# EAGLE design tapecleaner (EAGLE 6.3)
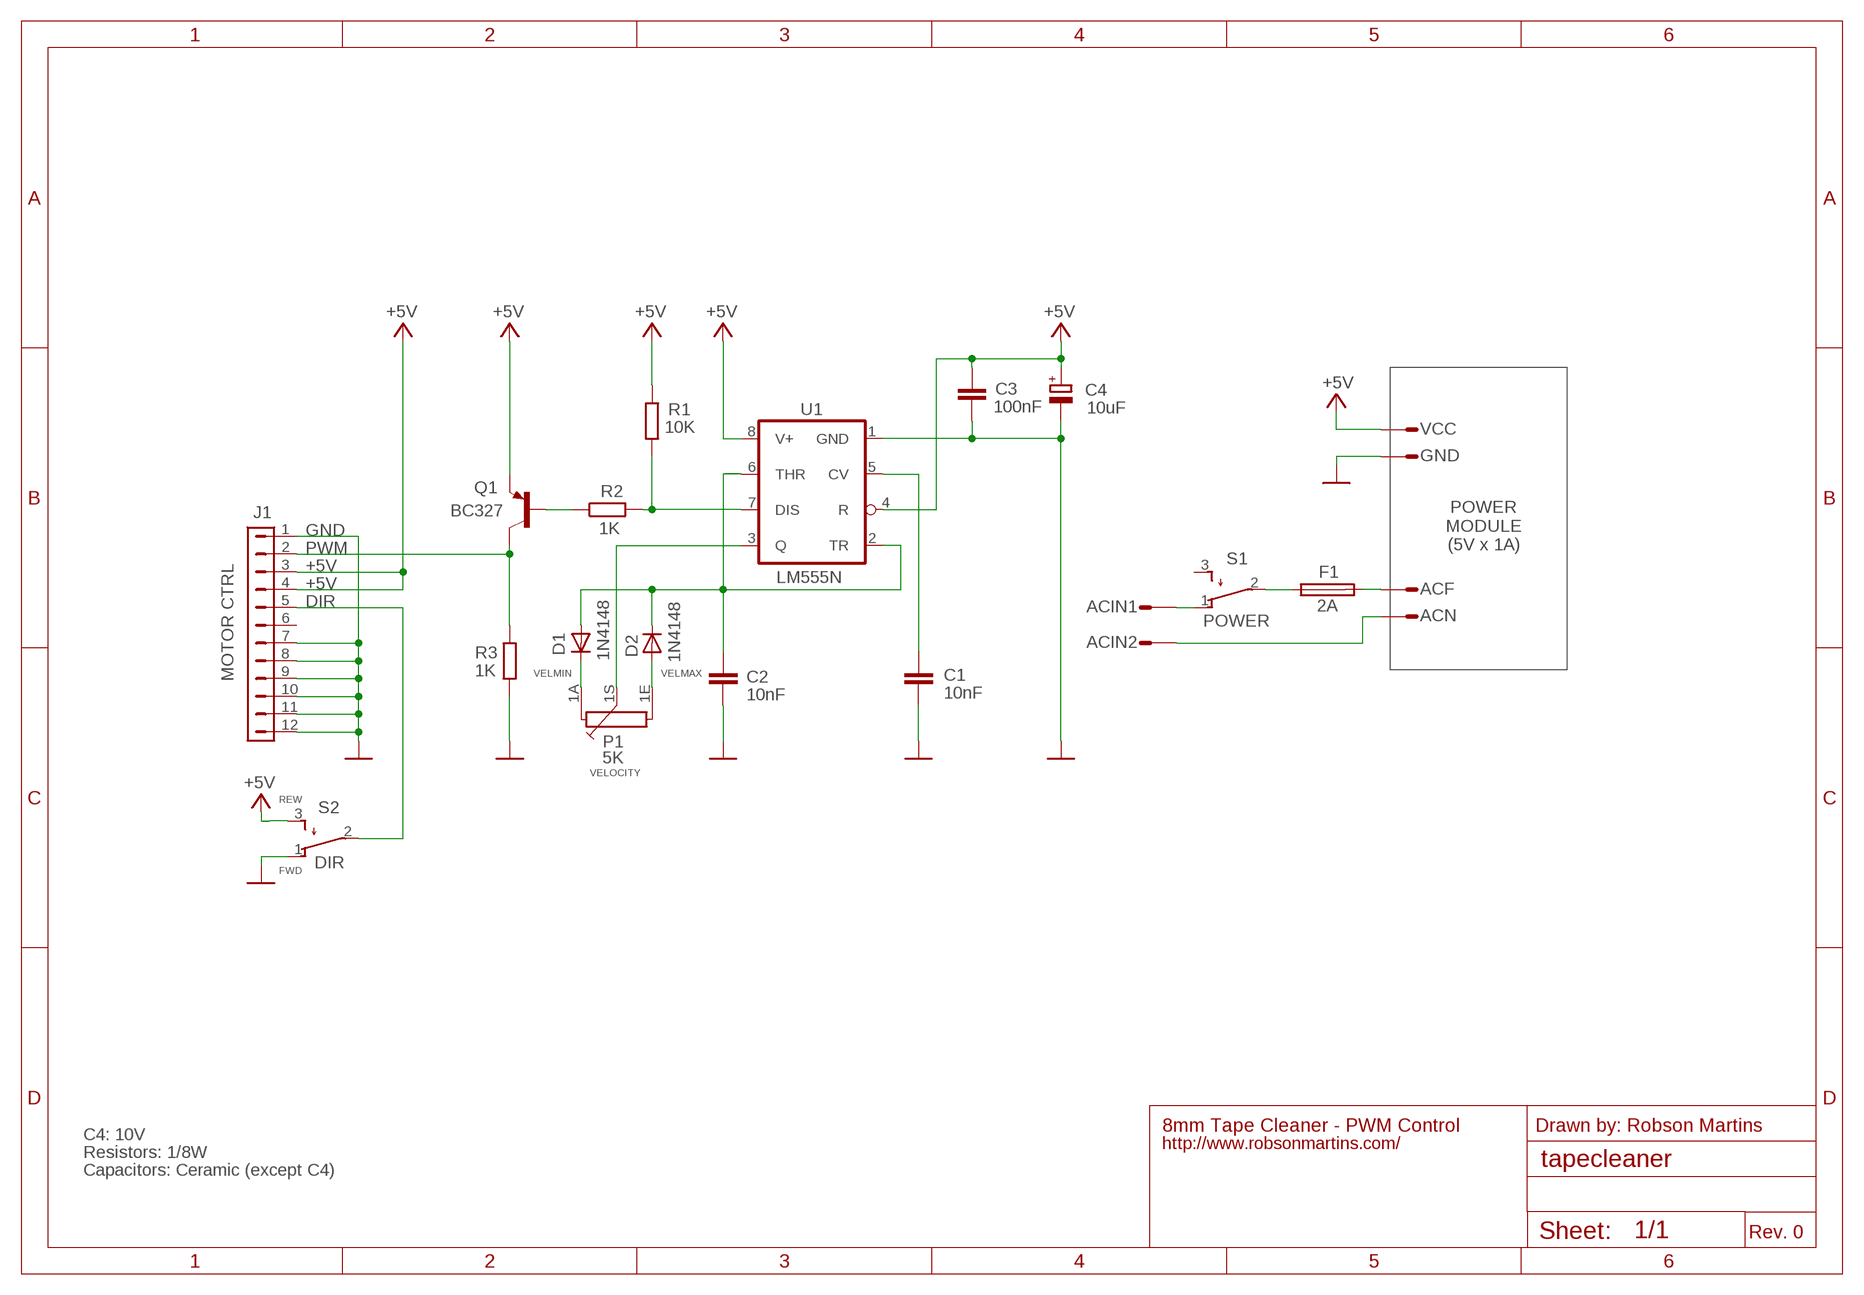
[diagram p0: schematic, sheet 1]

## Parts
ACF  ST2,8  [ST2,8]
ACIN1  ST2,8  [ST2,8]
ACIN2  ST2,8  [ST2,8]
ACN  ST2,8  [ST2,8]
C1  10nF  C-EU050-025X075  [C050-025X075]
C2  10nF  C-EU050-025X075  [C050-025X075]
C3  100nF  C-EU050-025X075  [C050-025X075]
C4  10uF  CPOL-EUE2,5-6E  [E2,5-6E]
D1  1N4148  1N4148DO35-7  [DO35-7]
D2  1N4148  1N4148DO35-7  [DO35-7]
F1  2A  FUSESHK20L  [SHK20L]
GND  ST2,8  [ST2,8]
J1  MOTOR CTRL  FH21-12S-1DSA  [FH21-12S-1DSA]
P1  5K  PC16S  [PC16S]
Q1  BC327  [TO92]
R1  10K  R-EU_0204/7  [0204/7]
R2  1K  R-EU_0204/7  [0204/7]
R3  1K  R-EU_0204/7  [0204/7]
S1  POWER  TL32WO  [TL3XWO]
S2  DIR  TL32WO  [TL3XWO]
U1  LM555N  [DIL08]
VCC  ST2,8  [ST2,8]

## Nets
555CV: C1.1 U1.5(CV)
555DIS: R1.2 R2.2 U1.7(DIS)
555TR: C2.1 D1.A D2.C U1.2(TR) U1.6(THR)
+5V: C3.1 C4.+ J1.3 J1.4 Q1.1(E) R1.1 S2.3(S) U1.4(R) U1.8(V+) VCC.1(ST)
ACIN1: ACIN1.1(ST) S1.1(O)
ACIN1_PWR: F1.1A S1.2(P)
ACIN2: ACIN2.1(ST) ACN.1(ST)
DIR: J1.5 S2.2(P)
GND: C1.2 C2.2 C3.2 C4.- GND.1(ST) J1.1 J1.7 J1.8 J1.9 J1.10 J1.11 J1.12 R3.2 S2.1(O) U1.1(GND)
N$1: ACF.1(ST) F1.2A
PWM: J1.2 Q1.3(C) R3.1
Q2B: Q1.2(B) R2.1
VEL: P1.1S U1.3(Q)
VELMAX: D2.A P1.1E
VELMIN: D1.C P1.1A
Unconnected: J1.6 S1.3(S)

## Notes on the sheet
- POWER
  MODULE
  (5V x 1A)
- VELOCITY
- REW
- FWD
- 8mm Tape Cleaner - PWM Control | Drawn by: Robson Martins
- C4: 10V
- http://www.robsonmartins.com/
- Resistors: 1/8W
- Capacitors: Ceramic (except C4)
- Rev. 0

## Library data of the parts
ACF ACIN1 ACIN2 ACN GND VCC = con-rib:ST2,8: RIBBON CABLE CONNECTOR Flachstecker / Faston; OC_FARNELL: unknown; OC_NEWARK: unknown
C1-C3 = rcl:C-EU: CAPACITOR, European symbol
C4 = rcl:CPOL-EU: POLARIZED CAPACITOR, European symbol
D1 D2 = diode:1N4148: DIODE high speed (Philips)
F1 = fuse:FUSE: Fuse; OC_FARNELL: unknown; OC_NEWARK: unknown
J1 = con-hirose:FH21-12S-1DSA: FPC CONNECTOR Source: con-hirose.lbr from Bob Starr <rtzaudio@mindspring.com>; OC_FARNELL: unknown; OC_NEWARK: unknown
P1 = piher:PC16S: POTENTIOMETER single carbon potentiometer, 16 mm, S3ROH; OC_FARNELL: 4452940; OC_NEWARK: unknown
Q1 = transistor-pnp:BC327: PNP Transistor
R1-R3 = resistor:R-EU_: RESISTOR, European symbol
S1 S2 = switch:TL32WO: TINY SWITCH ON - MOM Source: http://www2.produktinfo.conrad.com/datenblaetter/700000-724999/705152-da-01-de-Subminiaturschalter_TL_36WO.pdf
U1 = linear:*555: TIMER

## Board
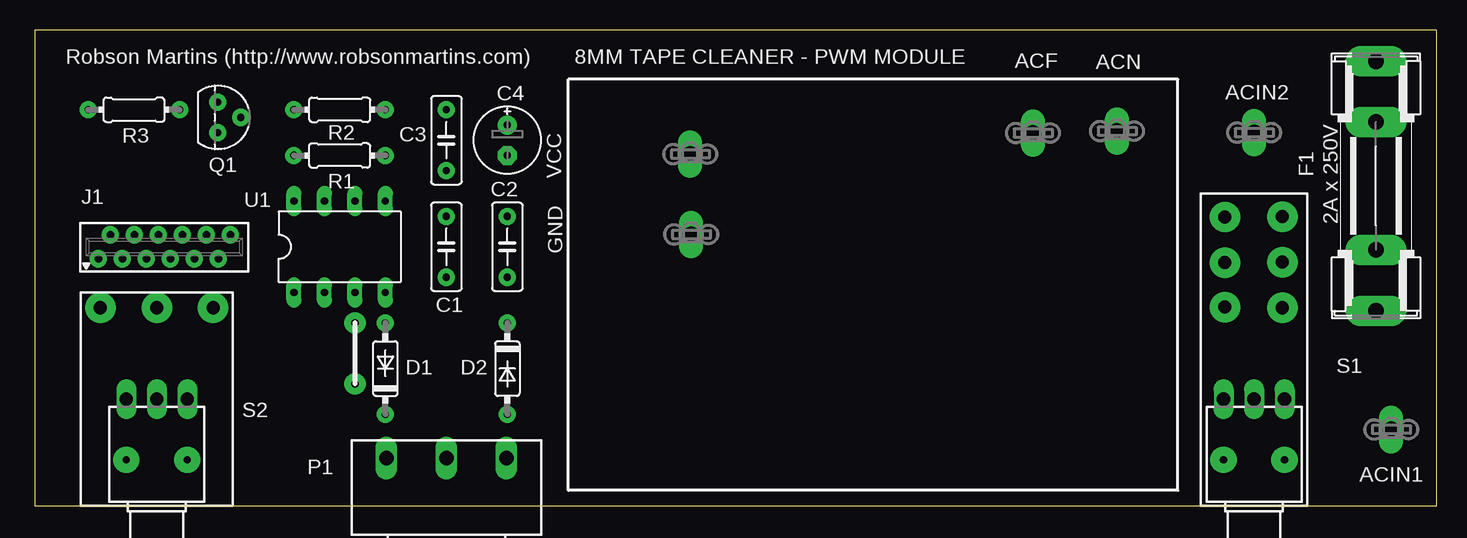
[diagram p1: board, top side]
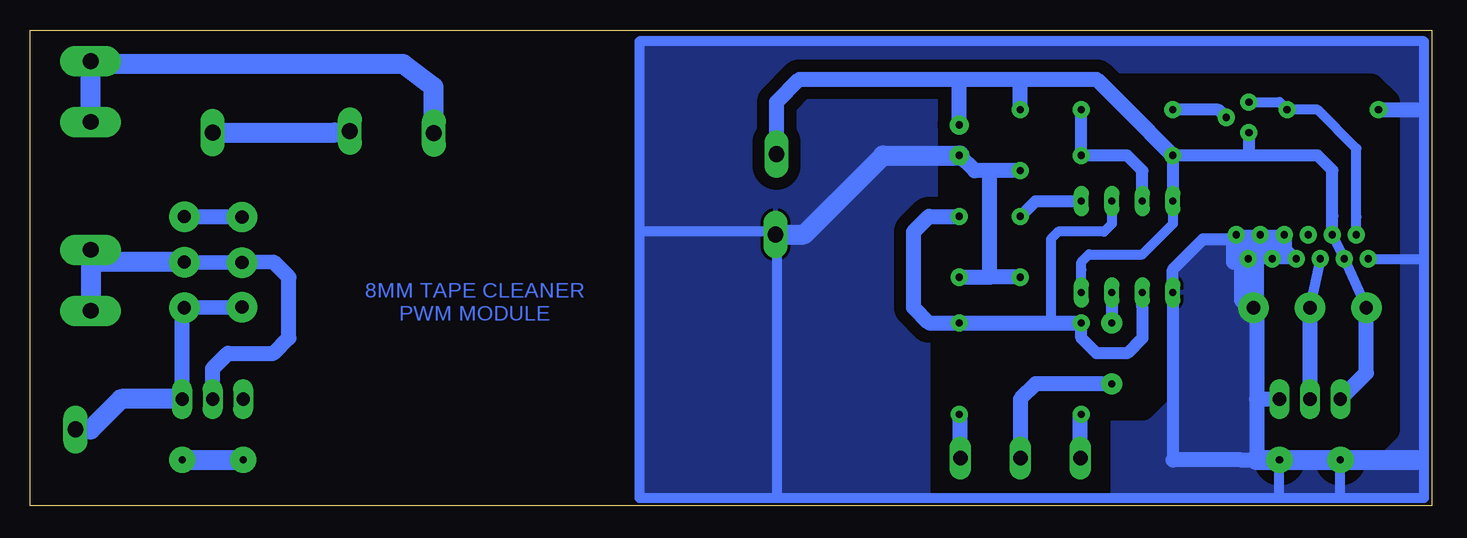
[diagram p2: board, bottom side, seen from below]

Size 116.82 x 39.67 mm. Coordinates in mm from the lower left corner, seen from the top.
Outline: 0,0 116.82,0 116.82,39.67 0,39.67 0,0
Copper layers (1*16): Top 0.035mm / dielectric 1.5mm / Bottom 0.035mm
Design rules "default": minimum track width 10mil, minimum drill 24mil, track to track 8mil, track to pad 8mil, pad to pad 8mil, via to via 8mil, smd to smd 8mil, copper to edge 40mil, drill to drill 8mil, minimum pad ring 10mil, minimum via ring 8mil, stop-mask expansion 4mil, vias tented up to drill 0mil, thermal gap 10mil
bRestrict: area 3.8,1.3 to 40.6,34.9

### Footprints (pad centres in the part's own frame; a part is rotated, then mirrored left to right if it is on the bottom)
ST2,8 = drill 1.321 long: 1 0,0
C050-025X075 = drill 0.6 pad 1.422: 1 -2.54,0; 2 2.54,0
E2,5-6E = drill 0.6 pad 1.575: + -1.27,0 | drill 0.6 pad 1.575 octagon: - 1.27,0
DO35-7 = drill 0.6 pad 1.422: A 3.81,0; C -3.81,0
SHK20L = drill 1.321 pad 2.54 long: 1A -10.414,0; 1B -5.334,0; 2A 10.414,0; 2B 5.334,0
FH21-12S-1DSA = drill 0.6 pad 1.422: 1 -5.5,-1; 2 -4.5,1; 3 -3.5,-1; 4 -2.5,1; 5 -1.5,-1; 6 -0.5,1; 7 0.5,-1; 8 1.5,1; 9 2.5,-1; 10 3.5,1; 11 4.5,-1; 12 5.5,1
PC16S = drill 1.2 long: 1A -5,6.5; 1E 5,6.5; 1S 0,6.5
TO92 = drill 0.6 pad 1.422: 1 1.27,0; 2 0,1.905; 3 -1.27,0
0204/7 = drill 0.6 pad 1.422: 1 -3.81,0; 2 3.81,0
TL3XWO = drill 1.1 pad 1.422 long: 1 -2.54,-5.08; 2 0,-5.08; 3 2.54,-5.08 | drill 0.6 pad 2.184: M1 -2.54,0; M2 2.54,0
DIL08 = drill 0.6 pad 1.27 long: 1 -3.81,-3.81; 2 -1.27,-3.81; 3 1.27,-3.81; 4 3.81,-3.81; 5 3.81,3.81; 6 1.27,3.81; 7 -1.27,3.81; 8 -3.81,3.81

### Placement (x,y rotation side)
ACF  83.17,31.08 0 top
ACIN1  113.03,6.35 0 top
ACIN2  101.6,31.11 0 top
ACN  90.17,31.24 0 top
C1  34.29,21.59 270 top
C2  39.37,21.59 270 top
C3  34.29,30.48 270 top
C4  39.37,30.48 270 top
D1  29.21,11.43 90 top
D2  39.37,11.43 270 top
F1  111.76,26.67 90 top
GND  54.69,22.62 0 top
J1  10.79,21.59 0 top
P1  34.29,-2.54 0 top
Q1  15.24,32.38 270 top
R1  25.4,29.21 0 top
R2  25.4,33.02 0 top
R3  8.26,33.02 180 top
S1  101.6,3.81 180 top
S2  10.16,3.81 180 top
U1  25.4,21.59 0 top
VCC  54.61,29.32 0 top

### Tracks (layer width: path | path; a pad name or v marks a point on that pad's centre or on a via)
555CV
  Bottom 1.016: C1.1 33.02,25.4 U1.5
555DIS
  Bottom 1.016: U1.7 24.13,27.94 25.4,29.21 R1.2 R2.2
555TR
  Bottom 0.813: U1.6 26.67,24.13 26.67,23.5 27.3,22.86 31.11,22.86 31.75,22.23 31.75,15.24
  Bottom 1.016: U1.2 24.13,16.51 24.13,13.97 25.4,12.7 27.94,12.7 29.21,13.97 D1.A
  Bottom 1.27: C2.1 41.91,24.13 43.18,22.86 43.18,16.51 41.91,15.24 D2.C 31.75,15.24 D1.A
+5V  (via drill 1.1 pad 2.54)
  Bottom 0.813: J1.4 J1.3 v5.46,16.51 | U1.4 29.21,19.68 29.21,20.32 28.57,20.95 24.13,20.95 21.59,23.5 U1.8
  Bottom 1.016: C3.1 34.29,35.56 | R1.1 21.59,27.94 | 21.59,27.94 U1.8 | R1.1 21.59,27.94 | Q1.1 15.24,29.84 15.24,29.21 | R1.1 15.88,29.21 15.24,29.21 | J1.4 8.29,24.17 8.29,27.98 9.53,29.21 13.34,29.21 15.24,29.21
  Bottom 1.27: C4.+ 39.37,35.56 | R1.1 25.4,33.02 27.94,35.56 34.29,35.56 | C3.1 34.29,35.56 | S2.3 5.46,11.05 v5.46,16.51 | VCC.1 54.61,33.66 52.7,35.56 39.37,35.56 | 39.37,35.56 34.29,35.56
ACIN1  (via drill 1.1 pad 2.54)
  Bottom 1.27: S1.1 104.14,13.97 104.14,15.24 v103.96,16.51 v99.16,16.57
  Bottom 1.676: S1.1 109.22,8.89 111.76,6.35 ACIN1.1
ACIN1_PWR  (via drill 1.1 pad 2.54)
  Bottom 1.27: v103.96,20.31 v99.16,20.27 96.52,20.32 95.25,19.05 95.25,13.97 96.52,12.7 100.33,12.7 101.6,11.43 S1.2 | 111.76,20.32 111.76,21.59
  Bottom 1.676: v103.96,20.31 111.76,20.32 | 111.76,21.59 F1.1A
ACIN2
  Bottom 1.676: ACIN2.1 91.44,31.11 ACN.1
DIR  (via drill 1.1 pad 2.54)
  Bottom 0.813: J1.5 v10.16,16.51
  Bottom 1.27: v10.16,16.51 S2.2
GND  (via drill 1.1 pad 2.54)
  Bottom 0.813: J1.8 J1.10 J1.12 | 12.06,22.23 12.06,21.36 J1.7 J1.9 J1.11 15.24,20.54 | 15.24,17.78 14.86,17.4 v14.86,16.51 14.61,16.77 14.61,17.14 | 12.7,0.64 40.64,0.64 54.61,0.64 | 12.7,0.64 7.62,0.64 | 7.62,0.64 0.64,0.64 0.64,3.81 | 0.64,3.81 0.64,20.32 | 0.64,20.32 0.64,33.02 | 0.64,33.02 0.64,33.66 0.64,38.73 66.04,38.73 66.04,22.86 | 66.04,22.86 66.04,0.64 54.61,0.64 | 1.27,3.81 0.64,3.81 | J1.1 0.91,20.59 0.64,20.32 | 7.62,0.64 7.62,3.81 | 12.7,0.64 12.7,3.81 | 54.61,0.64 54.61,22.86 66.04,22.86 | 1.27,33.02 0.64,33.02
  Bottom 1.016: 36.83,19.05 C1.2 | 21.59,3.81 21.59,5.08 21.59,10.16 21.59,11.43 21.59,12.7 U1.1 21.59,19.68 19.05,22.23 16.51,22.23
  Bottom 1.27: C2.2 36.83,19.05 | C3.2 36.83,27.94 | 36.83,27.94 38.1,27.94 C4.- | v14.86,16.51 14.61,16.51 | 14.61,16.51 14.61,8.89 | 14.61,8.89 S2.1 | 21.59,3.81 15.88,3.81 14.61,3.81 14.61,8.89 | 14.61,17.14 14.61,20.32 16.51,20.32 16.51,21.59 | 16.51,21.59 16.51,22.23 | 15.88,22.23 12.7,22.23 12.7,20.95 13.34,21.59 16.51,21.59 | 16.51,21.59 15.88,20.95 15.88,17.14 15.24,16.51 14.61,16.51 | C1.2 36.83,19.05 | 36.83,19.05 36.83,27.94 | R3.2 1.27,33.02
  Bottom 1.676: GND.1 52.31,22.62 45.72,29.21 C4.- | 14.61,3.81 12.7,3.81 7.62,3.81 1.27,3.81
  pour Bottom (isolate 1.016): 66.04,38.73 66.04,0 0,0 0,38.73
N$1
  Bottom 1.676: ACF.1 83.19,34.92 85.72,36.83 109.86,36.83 F1.2A
N$2
  Bottom 1.676: 104.14,3.81 99.06,3.81
N$4  (via drill 1.1 pad 2.54)
  other vias: 99.16,24.07
N$7
  Bottom 1.27: 104.14,24.13 99.06,24.13
N$8
  Bottom 1.676: 111.76,31.75 111.76,36.83
N$9  (via drill 1.1 pad 2.54)
  other vias: 103.96,24.11
PWM
  Bottom 0.813: J1.2 6.29,24.07 6.29,29.79 9.53,33.02 R3.1 12.7,33.66 Q1.3
Q2B
  Bottom 1.016: Q1.2 17.78,33.02 R2.1
VEL  (via drill 0.6 pad 1.78)
  Top 0.305: v26.67,10.16 v26.67,15.24
  Bottom 1.016: U1.3 v26.67,15.24
  Bottom 1.27: v26.67,10.16 33.02,10.16 34.29,8.89 P1.1S
VELMAX
  Bottom 1.27: P1.1E 39.29,7.54 D2.A
VELMIN
  Bottom 1.27: P1.1A 29.29,7.54 D1.C

### Text on the board
Bottom: 8MM TAPE CLEANER / PWM MODULE
tPlace: Robson Martins (http://www.robsonmartins.com) | 8MM TAPE CLEANER - PWM MODULE | 2A x 250V